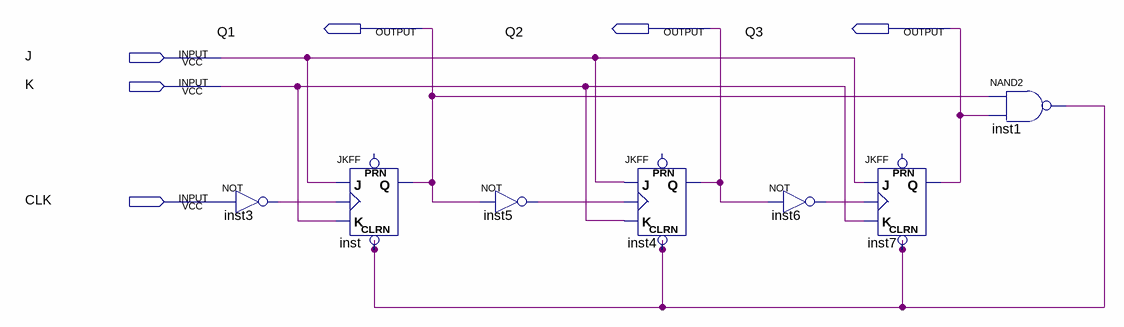
[diagram p0: schematic sheet]
// Quartus schematic ex2-1-remake.bdf as structural Verilog: 7 symbols, 6 pins
module \ex2-1-remake  (
  input  J,
  input  K,
  input  CLK,
  output Q1,
  output Q2,
  output Q3
);

  wire inst1_out, inst3_out, inst5_out, inst6_out;

  not inst3 (inst3_out, CLK);
  JKFF inst (.CLRN(inst1_out), .K(K), .J(J), .CLK(inst3_out), .Q(Q1));  // open: PRN
  not inst5 (inst5_out, Q1);
  JKFF inst4 (.CLRN(inst1_out), .K(K), .J(J), .CLK(inst5_out), .Q(Q2));  // open: PRN
  not inst6 (inst6_out, Q2);
  JKFF inst7 (.CLRN(inst1_out), .K(K), .J(J), .CLK(inst6_out), .Q(Q3));  // open: PRN
  nand inst1 (inst1_out, Q1, Q3);
endmodule
